# Altium schematic sheet INC-MBPCM1-01.SchDoc
size A2
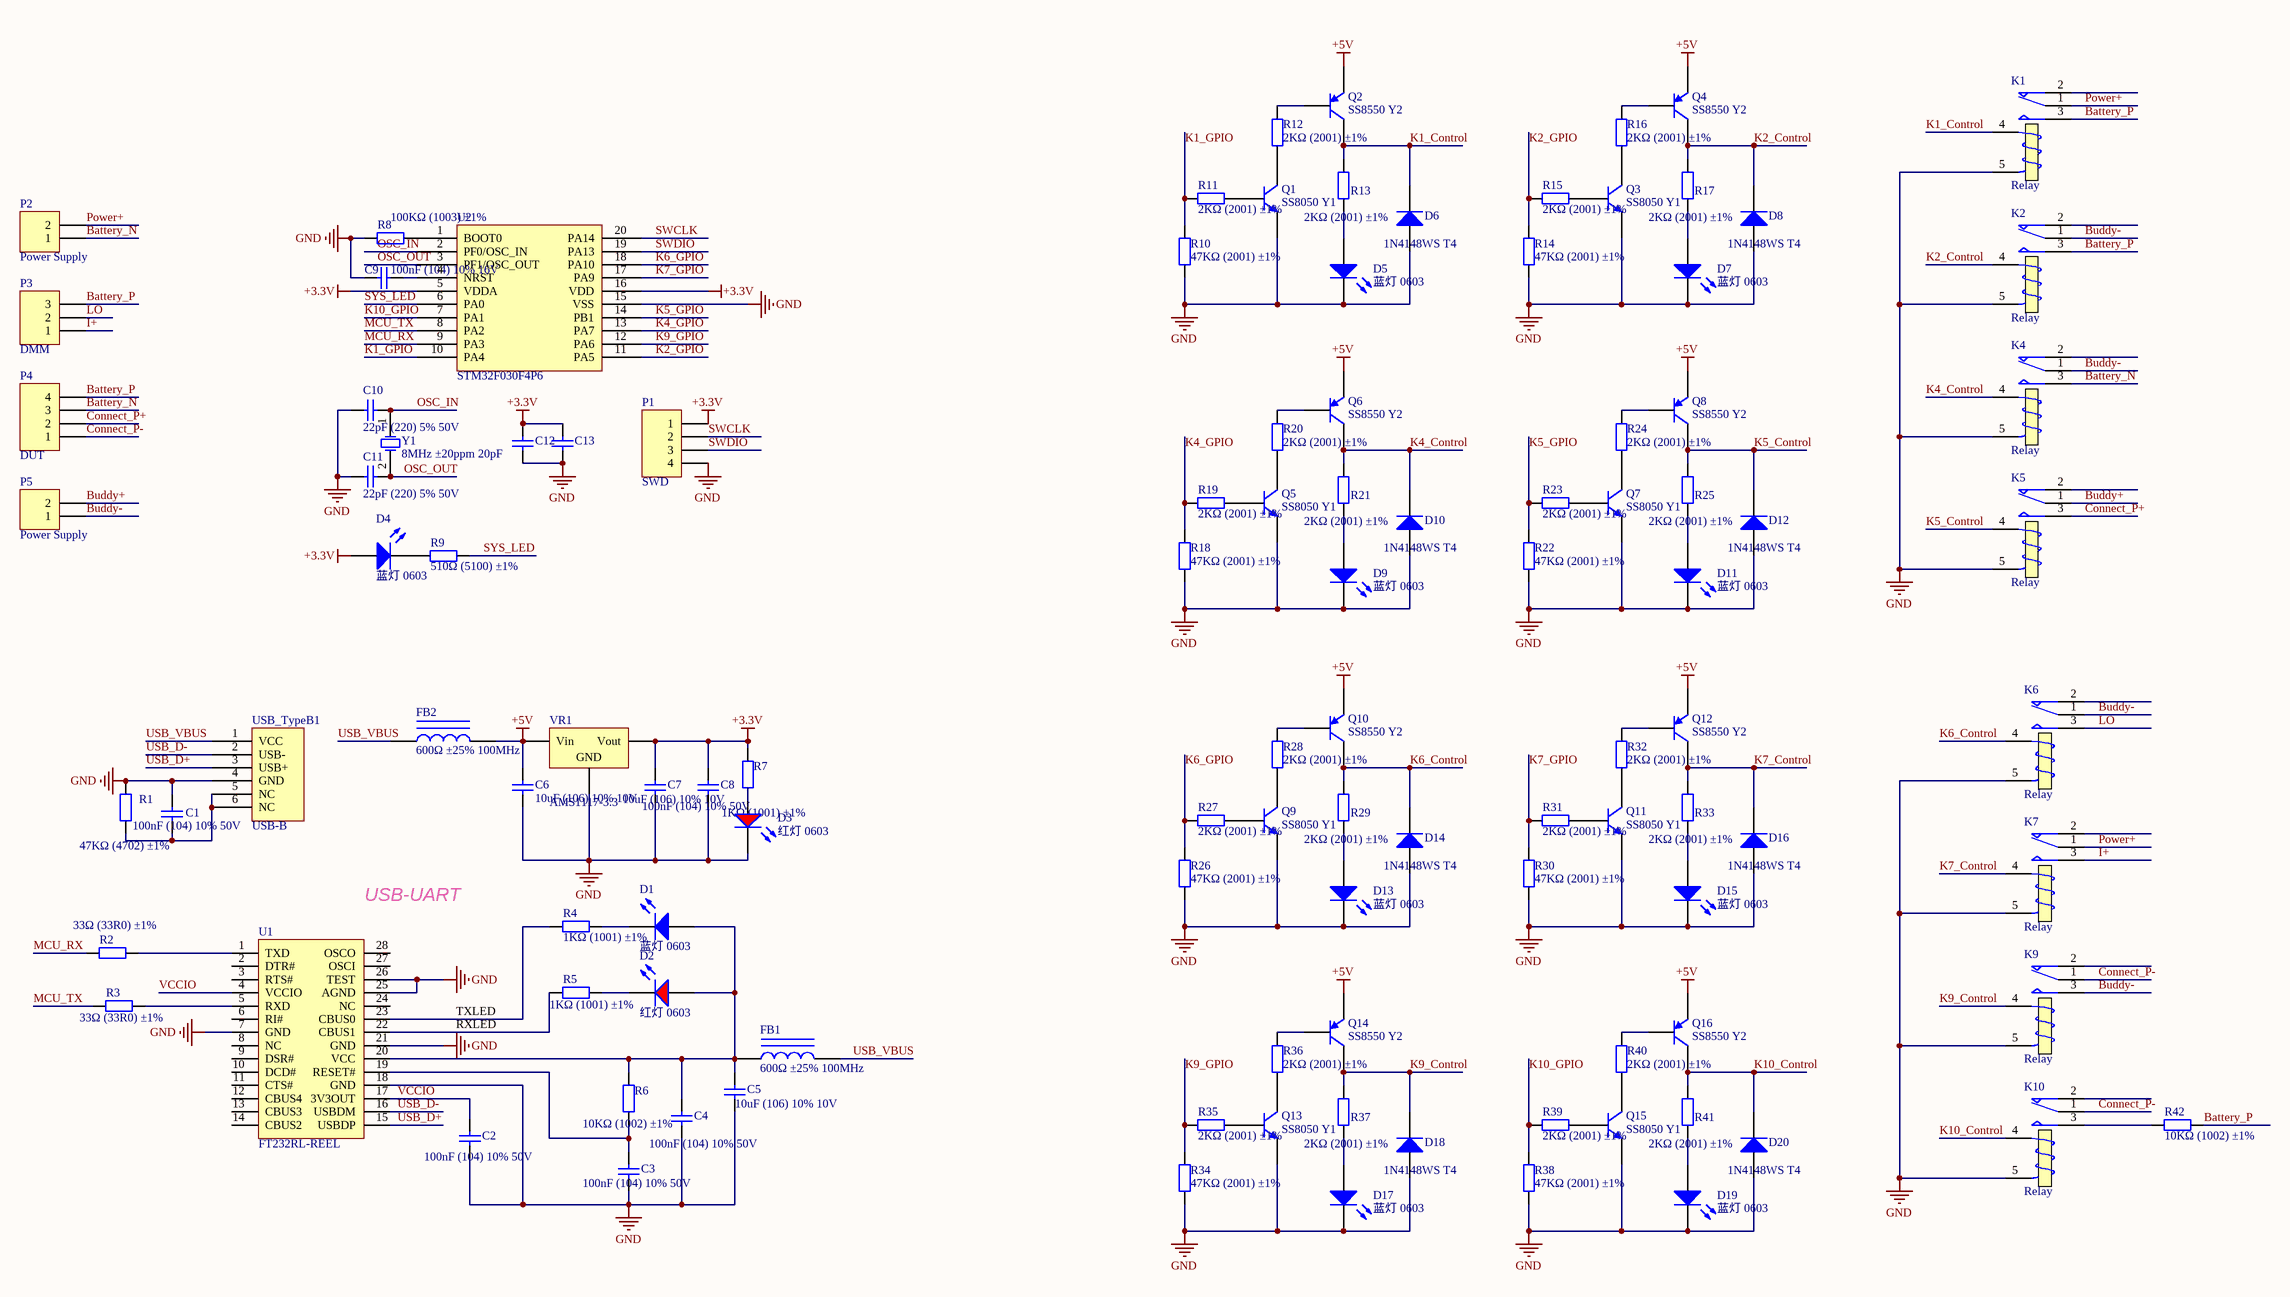
[diagram p0: INC-MBPCM1-01.SchDoc]

## Parts
C1  100nF (104) 10% 50V  [0603_C]
C2  100nF (104) 10% 50V  [0603_C]
C3  100nF (104) 10% 50V  [0603_C]
C4  100nF (104) 10% 50V  [0603_C]
C5  10uF (106) 10% 10V  [0603_C]
C6  10uF (106) 10% 10V  [0603_C]
C7  10uF (106) 10% 10V  [0603_C]
C8  100nF (104) 10% 50V  [0603_C]
C9  100nF (104) 10% 16V  [0402_C]
C10  22pF (220) 5% 50V  [0603_C]
C11  22pF (220) 5% 50V  [0603_C]
C12  100nF (104) 10% 16V  [0402_C]  (value not drawn)
C13  100nF (104) 10% 16V  [0402_C]  (value not drawn)
D1  蓝灯 0603  [0603_LED_S1]
D2  红灯 0603  [0603_LED_S1]
D3  红灯 0603  [0603_LED_S1]
D4  蓝灯 0603  [0603_LED_S1]
D5  蓝灯 0603  [0603_LED_S1]
D6  1N4148WS T4  [SOD-323]
D7  蓝灯 0603  [0603_LED_S1]
D8  1N4148WS T4  [SOD-323]
D9  蓝灯 0603  [0603_LED_S1]
D10  1N4148WS T4  [SOD-323]
D11  蓝灯 0603  [0603_LED_S1]
D12  1N4148WS T4  [SOD-323]
D13  蓝灯 0603  [0603_LED_S1]
D14  1N4148WS T4  [SOD-323]
D15  蓝灯 0603  [0603_LED_S1]
D16  1N4148WS T4  [SOD-323]
D17  蓝灯 0603  [0603_LED_S1]
D18  1N4148WS T4  [SOD-323]
D19  蓝灯 0603  [0603_LED_S1]
D20  1N4148WS T4  [SOD-323]
FB1  600Ω ±25% 100MHz  [0805_L]
FB2  600Ω ±25% 100MHz  [0805_L]
K1  Relay  [插件继电器 G5V-1]
K2  Relay  [插件继电器 G5V-1]
K4  Relay  [插件继电器 G5V-1]
K5  Relay  [插件继电器 G5V-1]
K6  Relay  [插件继电器 G5V-1]
K7  Relay  [插件继电器 G5V-1]
K9  Relay  [插件继电器 G5V-1]
K10  Relay  [插件继电器 G5V-1]
P1  SWD  [XH连接器 4P-2.5]
P2  Header 2  [WJ15EDGVC-3.81-2P]  (value not drawn)
P3  Header 3  [WJ15EDGVC-3.81-3P]  (value not drawn)
P4  Header 4  [WJ15EDGVC-3.81-4P]  (value not drawn)
P5  Header 2  [WJ15EDGVC-3.81-2P]  (value not drawn)
Q1  SS8050 Y1  [SOT-23(SOT-23-3)]
Q2  SS8550 Y2  [SOT-23(SOT-23-3)]
Q3  SS8050 Y1  [SOT-23(SOT-23-3)]
Q4  SS8550 Y2  [SOT-23(SOT-23-3)]
Q5  SS8050 Y1  [SOT-23(SOT-23-3)]
Q6  SS8550 Y2  [SOT-23(SOT-23-3)]
Q7  SS8050 Y1  [SOT-23(SOT-23-3)]
Q8  SS8550 Y2  [SOT-23(SOT-23-3)]
Q9  SS8050 Y1  [SOT-23(SOT-23-3)]
Q10  SS8550 Y2  [SOT-23(SOT-23-3)]
Q11  SS8050 Y1  [SOT-23(SOT-23-3)]
Q12  SS8550 Y2  [SOT-23(SOT-23-3)]
Q13  SS8050 Y1  [SOT-23(SOT-23-3)]
Q14  SS8550 Y2  [SOT-23(SOT-23-3)]
Q15  SS8050 Y1  [SOT-23(SOT-23-3)]
Q16  SS8550 Y2  [SOT-23(SOT-23-3)]
R1  47KΩ (4702) ±1%  [0603_R]
R2  33Ω (33R0) ±1%  [0603_R]
R3  33Ω (33R0) ±1%  [0603_R]
R4  1KΩ (1001) ±1%  [0603_R]
R5  1KΩ (1001) ±1%  [0603_R]
R6  10KΩ (1002) ±1%  [0603_R]
R7  1KΩ (1001) ±1%  [0603_R]
R8  100KΩ (1003) ±1%  [0402_R]
R9  510Ω (5100) ±1%  [0603_R]
R10  47KΩ (2001) ±1%  [0603_R]
R11  2KΩ (2001) ±1%  [0603_R]
R12  2KΩ (2001) ±1%  [0603_R]
R13  2KΩ (2001) ±1%  [0603_R]
R14  47KΩ (2001) ±1%  [0603_R]
R15  2KΩ (2001) ±1%  [0603_R]
R16  2KΩ (2001) ±1%  [0603_R]
R17  2KΩ (2001) ±1%  [0603_R]
R18  47KΩ (2001) ±1%  [0603_R]
R19  2KΩ (2001) ±1%  [0603_R]
R20  2KΩ (2001) ±1%  [0603_R]
R21  2KΩ (2001) ±1%  [0603_R]
R22  47KΩ (2001) ±1%  [0603_R]
R23  2KΩ (2001) ±1%  [0603_R]
R24  2KΩ (2001) ±1%  [0603_R]
R25  2KΩ (2001) ±1%  [0603_R]
R26  47KΩ (2001) ±1%  [0603_R]
R27  2KΩ (2001) ±1%  [0603_R]
R28  2KΩ (2001) ±1%  [0603_R]
R29  2KΩ (2001) ±1%  [0603_R]
R30  47KΩ (2001) ±1%  [0603_R]
R31  2KΩ (2001) ±1%  [0603_R]
R32  2KΩ (2001) ±1%  [0603_R]
R33  2KΩ (2001) ±1%  [0603_R]
R34  47KΩ (2001) ±1%  [0603_R]
R35  2KΩ (2001) ±1%  [0603_R]
R36  2KΩ (2001) ±1%  [0603_R]
R37  2KΩ (2001) ±1%  [0603_R]
R38  47KΩ (2001) ±1%  [0603_R]
R39  2KΩ (2001) ±1%  [0603_R]
R40  2KΩ (2001) ±1%  [0603_R]
R41  2KΩ (2001) ±1%  [0603_R]
R42  10KΩ (1002) ±1%  [0805_R]
U1  FT232RL-REEL  [SSOP-28_208mil]
U2  STM32F030F4P6  [TSSOP-20]
USB_TypeB1  USB-B  [USB_TypeB]
VR1  AMS1117-3.3  [SOT-223]
Y1  8MHz ±20ppm 20pF  [SMD-5032_2P]

## Nets
+3.3V: C7.1 C8.2 C12.2 C13.2 D4.A P1.1 R7.1 U2.5(VDDA) U2.16(VDD) VR1.2(Vout)
+5V: C6.2 FB2.2 Q2.2(E) Q4.2(E) Q6.2(E) Q8.2(E) Q10.2(E) Q12.2(E) Q14.2(E) Q16.2(E) VR1.3(Vin)
GND: C1.2 C2.2 C3.2 C4.1 C5.1 C6.1 C7.2 C8.1 C9.2 C10.1 C11.1 C12.1 C13.1 D3.K D5.K D6.1(A) D7.K D8.1(A) D9.K D10.1(A) D11.K D12.1(A) D13.K D14.1(A) D15.K D16.1(A) D17.K D18.1(A) D19.K D20.1(A) K1.5(T2) K2.5(T2) K4.5(T2) K5.5(T2) K6.5(T2) K7.5(T2) K9.5(T2) K10.5(T2) P1.4 Q1.2(E) Q3.2(E) Q5.2(E) Q7.2(E) Q9.2(E) Q11.2(E) Q13.2(E) Q15.2(E) R1.2 R8.1 R10.1 R14.1 R18.1 R22.1 R26.1 R30.1 R34.1 R38.1 U1.7(GND) U1.18(GND) U1.21(GND) U1.25(AGND) U1.26(TEST) U2.15(VSS) USB_TypeB1.4(GND) VR1.1(GND)
Battery_N: K4.3(NO) P2.1 P4.3
Battery_P: K1.3(NO) K2.3(NO) P3.3 P4.4 R42.2
Buddy+: K5.1(COM) P5.2
Buddy-: K2.1(COM) K4.1(COM) K6.1(COM) K9.3(NO) P5.1
Connect_P+: K5.3(NO) P4.2
Connect_P-: K9.1(COM) K10.1(COM) P4.1
I+: K7.3(NO) P3.1
K1_Control: D6.2(K) K1.4(T1) Q2.3(C) R13.1
K1_GPIO: R10.2 R11.2 U2.10(PA4)
K2_Control: D8.2(K) K2.4(T1) Q4.3(C) R17.1
K2_GPIO: R14.2 R15.2 U2.11(PA5)
K4_Control: D10.2(K) K4.4(T1) Q6.3(C) R21.1
K4_GPIO: R18.2 R19.2 U2.13(PA7)
K5_Control: D12.2(K) K5.4(T1) Q8.3(C) R25.1
K5_GPIO: R22.2 R23.2 U2.14(PB1)
K6_Control: D14.2(K) K6.4(T1) Q10.3(C) R29.1
K6_GPIO: R26.2 R27.2 U2.18(PA10)
K7_Control: D16.2(K) K7.4(T1) Q12.3(C) R33.1
K7_GPIO: R30.2 R31.2 U2.17(PA9)
K9_Control: D18.2(K) K9.4(T1) Q14.3(C) R37.1
K9_GPIO: R34.2 R35.2 U2.12(PA6)
K10_Control: D20.2(K) K10.4(T1) Q16.3(C) R41.1
K10_GPIO: R38.2 R39.2 U2.7(PA1)
LO: K6.3(NO) P3.2
MCU_RX: R2.1 U2.9(PA3)
MCU_TX: R3.1 U2.8(PA2)
OSC_IN: C10.2 U2.2(PF0/OSC_IN) Y1.1(OSC1)
OSC_OUT: C11.2 U2.3(PF1/OSC_OUT) Y1.2(OSC2)
Power+: K1.1(COM) K7.1(COM) P2.2
SWCLK: P1.2 U2.20(PA14)
SWDIO: P1.3 U2.19(PA13)
SYS_LED: R9.2 U2.6(PA0)
USB_D+: U1.15(USBDP) USB_TypeB1.3(USB+)
USB_D-: U1.16(USBDM) USB_TypeB1.2(USB-)
USB_VBUS: FB1.2 FB2.1 USB_TypeB1.1(VCC)
VCCIO: C2.1 U1.4(VCCIO) U1.17(3V3OUT)
NetC1_1: C1.1 R1.1 USB_TypeB1.5(NC) USB_TypeB1.6(NC)
NetC3_1: C3.1 R6.1 U1.19(RESET#)
NetC4_2: C4.2 C5.2 D1.A D2.A FB1.1 R6.2 U1.20(VCC)
NetC9_1: C9.1 U2.4(NRST)
NetD1_K: D1.K R4.1
NetD2_K: D2.K R5.2
NetD3_A: D3.A R7.2
NetD4_K: D4.K R9.1
NetD5_A: D5.A R13.2
NetD7_A: D7.A R17.2
NetD9_A: D9.A R21.2
NetD11_A: D11.A R25.2
NetD13_A: D13.A R29.2
NetD15_A: D15.A R33.2
NetD17_A: D17.A R37.2
NetD19_A: D19.A R41.2
NetK10_3: K10.3(NO) R42.1
NetQ1_1: Q1.1(B) R11.1
NetQ1_3: Q1.3(C) R12.1
NetQ2_1: Q2.1(B) R12.2
NetQ3_1: Q3.1(B) R15.1
NetQ3_3: Q3.3(C) R16.1
NetQ4_1: Q4.1(B) R16.2
NetQ5_1: Q5.1(B) R19.1
NetQ5_3: Q5.3(C) R20.1
NetQ6_1: Q6.1(B) R20.2
NetQ7_1: Q7.1(B) R23.1
NetQ7_3: Q7.3(C) R24.1
NetQ8_1: Q8.1(B) R24.2
NetQ9_1: Q9.1(B) R27.1
NetQ9_3: Q9.3(C) R28.1
NetQ10_1: Q10.1(B) R28.2
NetQ11_1: Q11.1(B) R31.1
NetQ11_3: Q11.3(C) R32.1
NetQ12_1: Q12.1(B) R32.2
NetQ13_1: Q13.1(B) R35.1
NetQ13_3: Q13.3(C) R36.1
NetQ14_1: Q14.1(B) R36.2
NetQ15_1: Q15.1(B) R39.1
NetQ15_3: Q15.3(C) R40.1
NetQ16_1: Q16.1(B) R40.2
NetR2_2: R2.2 U1.1(TXD)
NetR3_2: R3.2 U1.5(RXD)
NetR4_2: R4.2 U1.23(CBUS0)
NetR5_1: R5.1 U1.22(CBUS1)
NetR8_2: R8.2 U2.1(BOOT0)

Not connected (* = marked no-connect by the designer): K1 2(NC); K2 2(NC); K4 2(NC); K5 2(NC); K6 2(NC); K7 2(NC); K9 2(NC); K10 2(NC); U1 2(DTR#) 3(RTS#) 6(RI#) 8(NC) 9(DSR#) 10(DCD#) 11(CTS#) 12(CBUS4) 13(CBUS3) 14(CBUS2) 24(NC) 27(OSCI) 28(OSCO)

## Notes on the sheet
- (near P2) Power Supply
- (near P3) DMM
- (near P4) DUT
- (near P5) Power Supply
- (near U1) USB-UART
- TXLED
- RXLED

## Library data of the parts
C1-C4 C8 = 0603 100nF (104) 10% 50V: 贴片电容; ComponentLink1Description: 供应商链接; ComponentLink1URL: http://www.szlcsc.com/product/details_15331.html; Package: 0603; Supplier: LC; SuppliersPartNumber: C14663
C5-C7 = 0603 10uF (106) 10% 10V: 贴片电容; ComponentLink1Description: 供应商链接; ComponentLink1URL: http://www.szlcsc.com/product/details_20411.html; Package: 0603; Supplier: LC; SuppliersPartNumber: C19702
C9 C12 C13 = 0402 100nF (104) 10% 16V: 贴片电容; ComponentLink1Description: 供应商链接; ComponentLink1URL: http://www.szlcsc.com/product/details_1877.html; Package: 0402; Supplier: LC; SuppliersPartNumber: C1525
C10 C11 = 0603 22pF (220) 5% 50V: 贴片电容; ComponentLink1Description: 供应商链接; ComponentLink1URL: http://www.szlcsc.com/product/details_2005.html; Package: 0603; Supplier: LC; SuppliersPartNumber: C1653
D1 D4 D5 D7 D9 D11 D13 D15 D17 D19 = 0603 蓝灯: 发光二极管; ComponentLink1Description: 供应商链接; ComponentLink1URL: http://www.szlcsc.com/product/details_73150.html; Package: 0603; Supplier: LC; SuppliersPartNumber: C72041
D2 D3 = 0603 红灯: 发光二极管; ComponentLink1Description: 供应商链接; ComponentLink1URL: http://www.szlcsc.com/product/details_2659.html; Package: 0603; Supplier: LC; SuppliersPartNumber: C2286
D6 D8 D10 D12 D14 D16 D18 D20 = SOD-323 1N4148WS T4: 二极管; ComponentLink1Description: 供应商链接; ComponentLink1URL: http://www.szlcsc.com/product/details_2485.html; Package: SOD-323; Supplier: LC; SuppliersPartNumber: C2128
FB1 FB2 = 0805 600Ω 25% 100MHz: 贴片磁珠; ComponentLink1Description: 供应商链接; ComponentLink1URL: http://www.szlcsc.com/product/details_1369.html; Package: 0805; Supplier: LC; SuppliersPartNumber: C1017
K1 K2 K4-K7 K9 K10 = Relay: SPDT Relay; Published: 8-Jun-2000; LatestRevisionDate: 17-Jul-2002; LatestRevisionNote: Re-released for DXP Platform.; PackageReference: MODULE5B; Publisher: Altium Limited
P1 = MHDR1X4: Header, 4-Pin; LatestRevisionDate: 17-Jul-2002; LatestRevisionNote: Re-released for DXP Platform.; Publisher: Altium Limited
P2 P5 = Header 2: Header, 2-Pin; LatestRevisionDate: 17-Jul-2002; LatestRevisionNote: Re-released for DXP Platform.; Publisher: Altium Limited
P3 = Header 3: Header, 3-Pin; LatestRevisionDate: 17-Jul-2002; LatestRevisionNote: Re-released for DXP Platform.; Publisher: Altium Limited
P4 = Header 4: Header, 4-Pin; LatestRevisionDate: 17-Jul-2002; LatestRevisionNote: Re-released for DXP Platform.; Publisher: Altium Limited
Q1 Q3 Q5 Q7 Q9 Q11 Q13 Q15 = SOT-23 SS8050 Y1: 三极管; ComponentLink1Description: 供应商链接; ComponentLink1URL: http://www.szlcsc.com/product/details_2507.html; Package: SOT-23; Supplier: LC; SuppliersPartNumber: C2150
Q2 Q4 Q6 Q8 Q10 Q12 Q14 Q16 = SOT-23 SS8550 Y2: 三极管; ComponentLink1Description: 供应商链接; ComponentLink1URL: http://www.szlcsc.com/product/details_9037.html; Package: SOT-23; Supplier: LC; SuppliersPartNumber: C8542
R1 = 0603 47KΩ (4702) 1%: 贴片电阻; ComponentLink1Description: 供应商链接; ComponentLink1URL: http://www.szlcsc.com/product/details_26562.html; Package: 0603; Supplier: LC; SuppliersPartNumber: C25819
R2 R3 = 0603 330Ω (3300) 1%: 贴片电阻; ComponentLink1Description: 供应商链接; ComponentLink1URL: http://www.szlcsc.com/product/details_23865.html; Package: 0603; Supplier: LC; SuppliersPartNumber: C23138
R4 R5 R7 = 0603 1KΩ (1001) 1%: 贴片电阻; ComponentLink1Description: 供应商链接; ComponentLink1URL: http://www.szlcsc.com/product/details_21904.html; Package: 0603; Supplier: LC; SuppliersPartNumber: C21190
R6 = 0603 10KΩ (1002) 1%: 贴片电阻; ComponentLink1Description: 供应商链接; ComponentLink1URL: http://www.szlcsc.com/product/details_26547.html; Package: 0603; Supplier: LC; SuppliersPartNumber: C25804
R8 = 0402 100KΩ (1003) 1%: 贴片电阻; ComponentLink1Description: 供应商链接; ComponentLink1URL: http://www.szlcsc.com/product/details_26484.html; Package: 0402; Supplier: LC; SuppliersPartNumber: C25741
R9 = 0603 510Ω (5100) 1%: 贴片电阻; ComponentLink1Description: 供应商链接; ComponentLink1URL: http://www.szlcsc.com/product/details_23920.html; Package: 0603; Supplier: LC; SuppliersPartNumber: C23193
R10-R41 = 0603 2KΩ (2001) 1%: 贴片电阻; ComponentLink1Description: 供应商链接; ComponentLink1URL: http://www.szlcsc.com/product/details_23702.html; Package: 0603; Supplier: LC; SuppliersPartNumber: C22975
R42 = 0805 10KΩ (1002) 1%: 贴片电阻; ComponentLink1Description: 供应商链接; ComponentLink1URL: http://www.szlcsc.com/product/details_18102.html; Package: 0805; Supplier: LC; SuppliersPartNumber: C17414
U1 = FT232RL
U2 = STM32F030F4P6: ARM; ComponentLink1Description: 供应商链接; ComponentLink1URL: http://www.szlcsc.com/product/details_33873.html; Package: TSSOP-20; Supplier: LC; SuppliersPartNumber: C32908
USB_TypeB1 = USB-6
VR1 = SOT-223 AMS1117-3.3: 低压差线性稳压(LDO); ComponentLink1Description: 供应商链接; ComponentLink1URL: http://www.szlcsc.com/product/details_6652.html; Package: SOT-223; Supplier: LC; SuppliersPartNumber: C6186
Y1 = SMD-5032_2P 8MHz 20ppm 20pF: 贴片晶振; ComponentLink1Description: 供应商链接; ComponentLink1URL: http://www.szlcsc.com/product/details_117214.html; Package: SMD-5032_2P; Supplier: LC; SuppliersPartNumber: C115962